# EasyEDA Pro project FOC第二版-FD6288Q-V2.0.epro, board PCB1
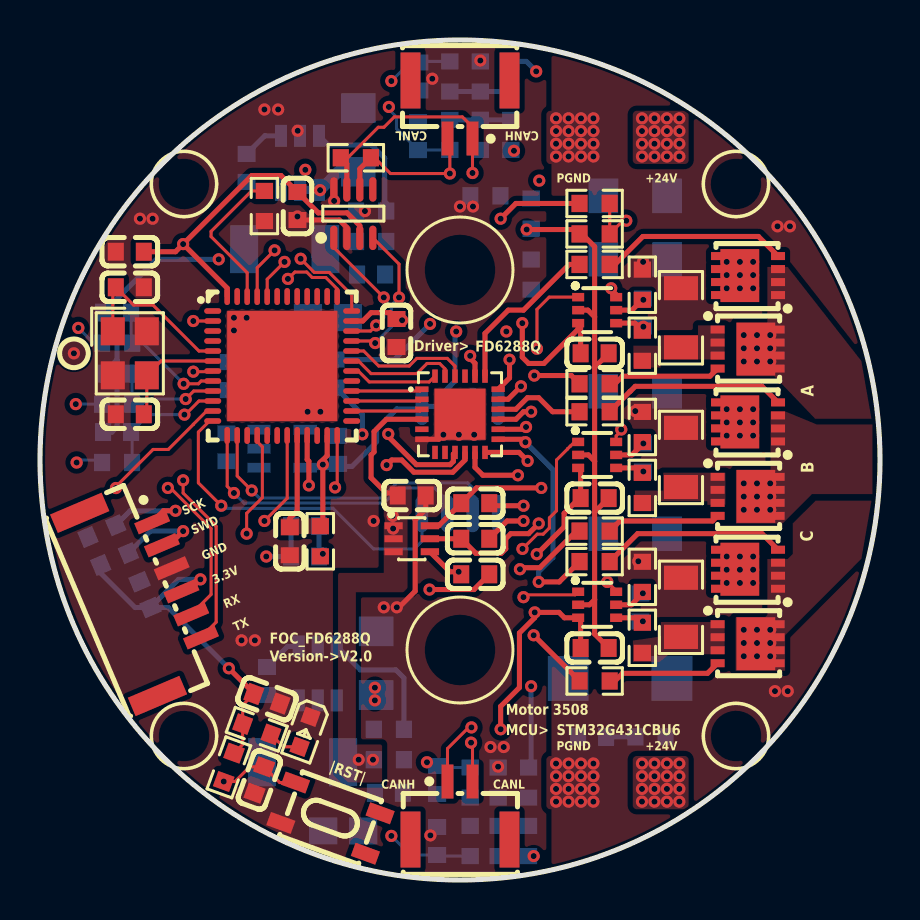
[diagram p1: board, top side]
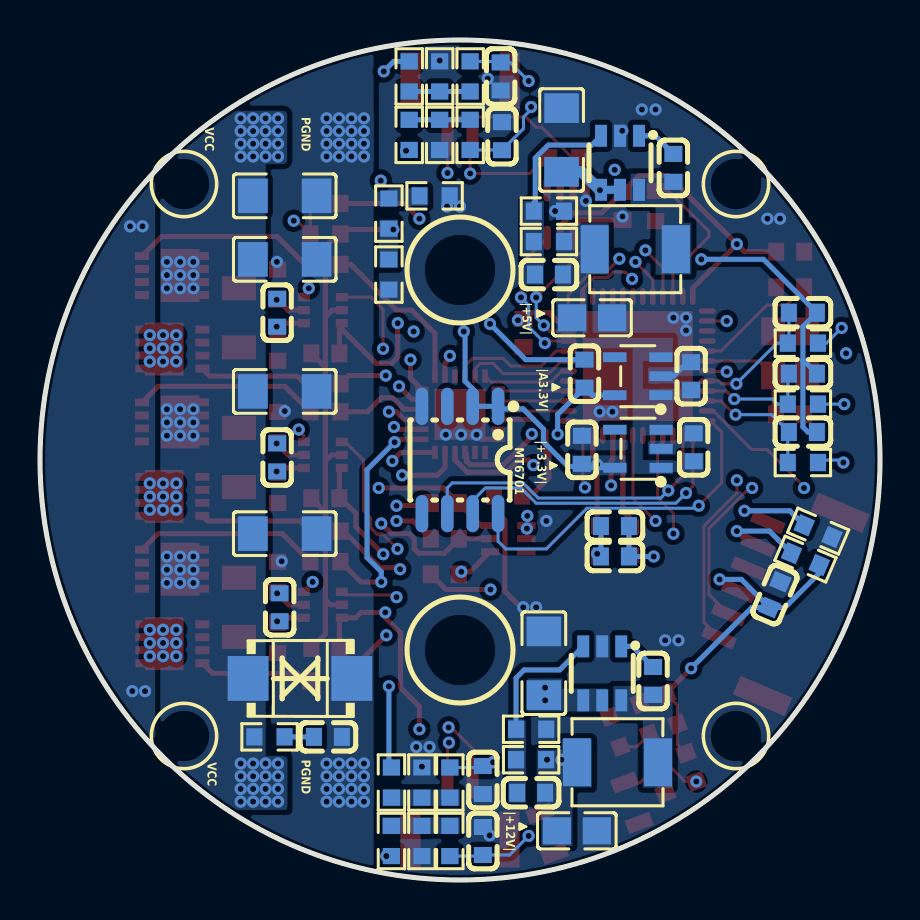
[diagram p2: board, bottom side, seen from below]

Outline 42 x 42 mm; copper layers: Top Layer, Inner1, Inner2, Bottom Layer. Coordinates in mm from the lower left corner of the outline.
Outline path: circle c21,21 r21
Stack: Top Layer 0.035mm 外层铜厚1oz / Dielectric1 0.2104mm 7628 RC49% 8.6mil / Inner1 0.0152mm 内层铜厚 / Dielectric2 1.065mm 1.1mm H/HOZ Copper / Inner2 0.0152mm 内层铜厚 / Dielectric3 0.2104mm 7628 RC49% 8.6mil / Bottom Layer 0.035mm 外层铜厚1oz

## Design rules (mm)
spacing copperThickness1oz (default): track to track 0.102, other pairs 0.152 to 0.3
spacing copperThickness2oz: track to track 0.203, other pairs 0.152 to 0.3
spacing Plane_innerPlane: track to track 0.102, other pairs 0.152 to 0.3
spacing Copper_copperRegion: track to track 0.102, other pairs 0.152 to 0.3
track width copperThickness1oz (default): min 0.127, default 0.254, max 2.54
track width copperThickness2oz: min 0.203, default 0.254, max 2.54
differential pair differentialPair (default): width min 0.127, default 0.254, max 2.54; gap min 0.152, default 0.152
pour e1140 uses Copper_copperRegion
pour e1142 uses Copper_copperRegion
pour e1144 uses Copper_copperRegion
pour e1146 uses Copper_copperRegion
pour e1148 uses Copper_copperRegion
pour e1150 uses Copper_copperRegion
pour e1152 uses Copper_copperRegion
pour e1154 uses Copper_copperRegion
pour e1156 uses Copper_copperRegion
pour e1158 uses Copper_copperRegion
pour e1160 uses Copper_copperRegion
pour e1162 uses Copper_copperRegion
pour e1164 uses Copper_copperRegion
pour e1166 uses Copper_copperRegion
pour e1168 uses Copper_copperRegion
pour e1170 uses Copper_copperRegion
pour e1182 uses Copper_copperRegion
pour e1184 uses Copper_copperRegion
pour e1187 uses Copper_copperRegion
pour e1196 uses Copper_copperRegion
pour e1201 uses Copper_copperRegion
pour e1202 uses Copper_copperRegion
pour e1206 uses Copper_copperRegion
pour e1213 uses Copper_copperRegion

## Placement (name value [footprint] x y rotation side)
C12  47uF/50V  [C1206]  15.92 37 270 bottom
C13  100pF  [C0603]  16.56 30.27 180 bottom
C14  22uF/25V  [C0805]  14.4 28.11 0 bottom
C29  10uF  [C0603]  12.87 33.7 90 top
C35  100nF  [C0603]  12.49 16.94 90 top
C36  100nF  [C0603]  4.49 31.41 0 top
C37  100nF  [C0603]  17.82 27.35 90 top
C41  1uF  [C0603]  13.25 16.17 0 bottom
C42  10nF  [C0603]  13.25 17.7 0 bottom
C45  100nF  [C0603]  10.97 5 250 top
C54  10nF/50V  [C0603]  27.6 7.16 180 bottom
C55  100uF/50V  [C1206]  29.76 24.43 0 bottom
C61  100uF/50V  [C1206]  29.76 17.32 0 bottom
C65  100nF  [C0603]  14.9 21.51 90 bottom
C68  100nF  [C0603]  11.35 9.06 340 top
C71  20pF  [C0603]  4.49 29.64 180 top
C72  20pF  [C0603]  4.49 23.29 0 top
C85  2.2nF  [C0603]  3.85 28.37 0 bottom
C88  100nF/50V  [C0603]  18.97 40.18 270 bottom
C92  1nF  [C0603]  30.02 13.63 270 bottom
C98  100nF/50V  [C0603]  19.86 1.95 90 bottom
C100  100nF  [C0603]  10.33 35.61 270 bottom
C101  100nF  [C0603]  11.35 9.95 270 bottom
C102  47uF/50V  [C1206]  16.81 10.84 270 bottom
C103  100pF  [C0603]  17.44 4.36 180 bottom
C104  22uF/25V  [C0805]  15.16 2.46 0 bottom
C105  100nF  [C0603]  9.32 21.64 90 bottom
C106  100nF  [C0603]  14.78 25.32 90 bottom
C107  100nF  [C0603]  9.44 25.19 90 bottom
C108  100uF/50V  [C1206]  29.76 31.03 0 bottom
C109  100uF/50V  [C1206]  29.76 34.21 0 bottom
C112  100nF  [C0603]  5.25 14.27 293 bottom
C113  1nF  [C0603]  30.14 21.13 270 bottom
C114  1nF  [C0603]  30.14 28.37 270 bottom
C115  2.2nF  [C0603]  3.85 25.32 0 bottom
C116  2.2nF  [C0603]  3.85 22.4 0 bottom
C117  100nF/50V  [C0603]  18.9 37.19 90 bottom
C118  100nF/50V  [C0603]  19.86 5 270 bottom
C120  100nF  [C0603]  27.73 26.33 180 top
C121  100nF  [C0603]  27.73 19.09 180 top
C122  100nF  [C0603]  27.73 11.6 180 top
C123  1uF/25V  [C0603]  21.76 15.28 180 top
C124  1uF/25V  [C0603]  21.76 17.06 180 top
C125  1uF/25V  [C0603]  21.76 18.84 180 top
C126  10uF/25V  [C0603]  18.59 19.22 180 top
CN1  WAFER-GH1.25-2PWB  [CONN-TH_2P-P1.25_XUNPU_WAFER-GH1.25-2PWB]  21 3.47 0 top
CN2  WAFER-GH1.25-2PWB  [CONN-TH_2P-P1.25_XUNPU_WAFER-GH1.25-2PWB]  21 38.53 180 top
D2  SMBJ36CA  [SMB_L4.4-W3.6-LS5.3-BI]  29 10.08 180 bottom
D3  BAS16TW  [SOT-363_L2.1-W1.3-P0.65-LS2.3-BL]  18.59 17.06 270 top
L4  3.3uH  [IND-SMD_L4.4-W4.2-A]  13.13 5.89 180 bottom
L5  3.3uH  [IND-SMD_L4.4-W4.2-A]  12.24 31.54 180 bottom
LED6  KT-0603R  [LED0603-RD]  13.25 7.41 250 top
Q7  NCEP3040Q  [POWERVDFN-8_L3.2-W3.1-P0.65-LS3.3-BL-1]  35.35 30.22 90 top
Q8  NCEP3040Q  [POWERVDFN-8_L3.2-W3.1-P0.65-LS3.3-BL-1]  35.35 22.91 90 top
Q9  NCEP3040Q  [POWERVDFN-8_L3.2-W3.1-P0.65-LS3.3-BL-1]  35.35 15.54 90 top
Q10  NCEP3040Q  [POWERVDFN-8_L3.2-W3.1-P0.65-LS3.3-BL-1]  35.43 26.55 270 top
Q11  NCEP3040Q  [POWERVDFN-8_L3.2-W3.1-P0.65-LS3.3-BL-1]  35.43 19.18 270 top
Q12  NCEP3040Q  [POWERVDFN-8_L3.2-W3.1-P0.65-LS3.3-BL-1]  35.43 11.81 270 top
R24  120  [R0603]  15.79 36.11 0 top
R28  0  [R0603]  14.01 16.94 90 top
R29  10K  [R0603]  11.22 33.7 270 top
R30  1K  [R0603]  9.44 5.63 250 top
R33  3.3  [R0603]  30.53 7.16 0 bottom
R40  56  [R0603]  3.85 26.84 0 bottom
R42  10  [R0603]  27.73 30.78 0 top
R43  34.8K  [R0603]  23.54 40.18 90 bottom
R44  56  [R0603]  20.49 40.18 90 bottom
R45  4.99K  [R0603]  22.02 40.18 270 bottom
R52  10  [R0603]  27.73 23.41 0 top
R53  10  [R0603]  27.73 15.92 0 top
R54  10  [R0603]  27.73 24.81 0 top
R56  10  [R0603]  27.73 9.95 0 top
R60  10  [R0603]  27.73 17.44 0 top
R65  34.8K  [R0603]  24.43 1.95 270 bottom
R66  56  [R0603]  21.51 1.95 270 bottom
R67  4.99K  [R0603]  22.91 1.95 90 bottom
R68  2mΩ  [R1206]  32.05 28.11 270 top
R69  2mΩ  [R1206]  32.05 21.13 270 top
R70  3mΩ  [R1206]  32.05 13.63 270 top
R72  110K  [R0603]  16.56 31.92 0 bottom
R73  15K  [R0603]  16.56 33.45 0 bottom
R74  390K  [R0603]  17.44 6.01 0 bottom
R75  20K  [R0603]  17.44 7.54 0 bottom
R79  1K  [R0603]  10.84 7.54 340 top
R80  0  [R0603]  24.56 30.27 90 bottom
R81  0  [R0603]  22.27 34.21 0 bottom
R82  0  [R0603]  24.56 33.32 90 bottom
R85  10K  [R0603]  3.73 16.05 203 bottom
R86  10K  [R0603]  3.09 17.44 23 bottom
R87  0  [R0603]  30.12 19.6 270 top
R88  0  [R0603]  30.12 22.65 90 top
R89  0  [R0603]  30.12 26.72 270 top
R90  0  [R0603]  30.12 29.76 90 top
R91  0  [R0603]  30.12 12.11 270 top
R92  0  [R0603]  30.12 15.16 90 top
R93  56  [R0603]  3.85 23.79 0 bottom
R94  56  [R0603]  3.85 20.87 0 bottom
R95  34.8K  [R0603]  23.54 37.26 270 bottom
R96  56  [R0603]  20.49 37.26 270 bottom
R97  4.99K  [R0603]  22.02 37.26 90 bottom
R98  34.8K  [R0603]  24.43 4.87 90 bottom
R99  56  [R0603]  21.51 4.87 90 bottom
R100  4.99K  [R0603]  22.91 4.87 270 bottom
R101  10K  [R0603]  27.73 33.83 0 top
R102  10K  [R0603]  27.73 32.3 180 top
SW1  K2-1808SN-A3SW-01  [SW-SMD_4P-L4.2-W3.3-P2.15-LS5.1]  14.52 3.09 340 top
U1  STM32G431CBU6  [VQFN-48_L7.0-W7.0-P0.50-BL-EP5.5]  12.11 25.7 270 top
U2  INA199A1DCKR  [SC-70-6_L2.2-W1.3-P0.65-LS2.1-BR]  27.86 28.49 180 top
U4  INA199A1DCKR  [SC-70-6_L2.2-W1.3-P0.65-LS2.1-BR]  27.86 13.76 180 top
U5  MAX3051EKA+T  [SOT-23-8_L3.0-W1.7-P0.65-LS2.8-TL]  15.67 33.32 90 top
U10  FD6288Q  [QFN-24_L4.0-W4.0-P0.50-BL-EP2.6]  21 23.29 270 top
U11  MT6701CT-STD  [SOP-8_L4.9-W3.9-P1.27-LS6.0-BL]  21 21 0 bottom
U13  SPX3819M5-L-3-3/TR  [SOT-23-5_L3.0-W1.7-P0.95-LS2.8-BL]  12.1 21.56 90 bottom
U20  INA199A1DCKR  [SC-70-6_L2.2-W1.3-P0.65-LS2.1-BR]  27.86 21.25 180 top
U23  ME3121AM6G  [SOT-23-6_L2.9-W1.6-P0.95-LS2.8-BR]  13 35.86 90 bottom
U24  ME3121AM6G  [SOT-23-6_L2.9-W1.6-P0.95-LS2.8-BR]  13.89 10.33 90 bottom
U25  SPX3819M5-L-3-3/TR  [SOT-23-5_L3.0-W1.7-P0.95-LS2.8-BL]  12.11 25.19 90 bottom
U26  WAFER-GH1.25-6PWB  [CONN-SMD_6P-P1.25_XUNPU_WAFER-GH1.25-6PWB]  5.38 14.4 293 top
X3  8MHz  [CRYSTAL-SMD_4P-L3.2-W2.5-BL]  4.49 26.33 270 top

## Footprints (pads in the part's own frame, mm; a bottom-side part is the same pattern mirrored in y, then rotated)
C0603
  rect 0.8x0.9 smd: 1(-0.7,0) 2(0.7,0)
C0805
  rect 1.41x1.35 smd: 1(-1,0) 2(1,0)
C1206
  rect 1.485x1.728 smd: 1(-1.593,0) 2(1.593,0)
CONN-SMD_6P-P1.25_XUNPU_WAFER-GH1.25-6PWB
  rect 0.6x1.7 smd: 1(-3.125,1.575) 2(-1.875,1.575) 3(-0.625,1.575) 4(0.625,1.575) 5(1.875,1.575) 6(3.125,1.575)
  rect 1x2.8 smd: 7(4.975,-1.575) 8(-4.975,-1.575)
CONN-TH_2P-P1.25_XUNPU_WAFER-GH1.25-2PWB
  rect 0.6x1.7 smd: 1(-0.625,1.45) 2(0.625,1.45)
  rect 1x2.8 smd: 3(-2.475,-1.45) 4(2.475,-1.45)
CRYSTAL-SMD_4P-L3.2-W2.5-BL
  rect 1.4x1.2 smd: 1(-1.1,-0.85) 2(1.1,-0.85) 3(1.1,0.85) 4(-1.1,0.85)
IND-SMD_L4.4-W4.2-A
  rect 1.4x2.4 smd: 1(2.028,0) 2(-2.028,0)
LED0603-RD
  rect 0.8x0.8 smd: 1(-0.799,0) 2(0.799,0)
POWERVDFN-8_L3.2-W3.1-P0.65-LS3.3-BL-1
  rect 0.4x0.7 smd: 1(-0.975,-1.55) 2(-0.325,-1.55) 3(0.325,-1.55) 4(0.975,-1.55)
  rect 0.4x0.5 smd: 5(0.975,1.55) 6(0.325,1.55) 7(-0.325,1.55) 8(-0.975,1.55)
  rect 2.65x1.94 smd: 8(0,0.36)
QFN-24_L4.0-W4.0-P0.50-BL-EP2.6
  rect 0.28x0.665 smd: 1(-1.25,-1.907) 2(-0.75,-1.907) 3(-0.25,-1.907) 4(0.25,-1.907) 5(0.75,-1.907) 6(1.25,-1.907) 13(1.25,1.907) 14(0.75,1.907) 15(0.25,1.907) 16(-0.25,1.907) 17(-0.75,1.907) 18(-1.25,1.907)
  rect 0.665x0.28 smd: 7(1.907,-1.25) 8(1.907,-0.75) 9(1.907,-0.25) 10(1.907,0.25) 11(1.907,0.75) 12(1.907,1.25) 19(-1.907,1.25) 20(-1.907,0.75) 21(-1.907,0.25) 22(-1.907,-0.25) 23(-1.907,-0.75) 24(-1.907,-1.25)
  rect 2.55x2.55 smd: 25(0,0)
R0603
  rect 0.806x0.864 smd: 1(-0.753,0) 2(0.753,0)
R1206
  rect 1.208x1.701 smd: 1(-1.479,0) 2(1.479,0)
SC-70-6_L2.2-W1.3-P0.65-LS2.1-BR
  rect 0.6x0.42 smd: 1(0.95,-0.65) 2(0.95,0) 3(0.95,0.65) 4(-0.95,0.65) 5(-0.95,0) 6(-0.95,-0.65)
SMB_L4.4-W3.6-LS5.3-BI
  rect 2.047x2.241 smd: 1(-2.591,0) 2(2.591,0)
SOP-8_L4.9-W3.9-P1.27-LS6.0-BL
  oval 0.63x1.865 smd: 1(-1.905,-2.683) 2(-0.635,-2.683) 3(0.635,-2.683) 4(1.905,-2.683) 5(1.905,2.683) 6(0.635,2.683) 7(-0.635,2.683) 8(-1.905,2.683)
SOT-23-5_L3.0-W1.7-P0.95-LS2.8-BL
  rect 0.49x1.157 smd: 1(-0.95,-1.153) 2(0,-1.153) 3(0.95,-1.153)
  rect 0.49x1.175 smd: 4(0.95,1.153) 5(-0.95,1.153)
SOT-23-6_L2.9-W1.6-P0.95-LS2.8-BR
  rect 1.1x0.6 smd: 1(1.35,-0.95) 2(1.35,0) 3(1.35,0.95) 4(-1.35,0.95) 5(-1.35,0) 6(-1.35,-0.95)
SOT-23-8_L3.0-W1.7-P0.65-LS2.8-TL
  oval 1.222x0.364 smd: 1(-1.211,0.975) 2(-1.211,0.325) 3(-1.211,-0.325) 4(-1.211,-0.975) 5(1.211,-0.975) 6(1.211,-0.325) 7(1.211,0.325) 8(1.211,0.975)
SOT-363_L2.1-W1.3-P0.65-LS2.3-BL
  rect 0.35x0.916 smd: 1(-0.65,-0.908) 2(0,-0.908) 3(0.65,-0.908) 4(0.65,0.908) 5(0,0.908) 6(-0.65,0.908)
SW-SMD_4P-L4.2-W3.3-P2.15-LS5.1
  rect 1.3x0.7 smd: 1(-2.25,1.075) 2(2.25,1.075) 3(-2.25,-1.075) 4(2.25,-1.075)
VQFN-48_L7.0-W7.0-P0.50-BL-EP5.5
  oval 0.28x0.85 smd: 1(-2.75,-3.474) 2(-2.25,-3.474) 3(-1.75,-3.474) 4(-1.25,-3.474) 5(-0.75,-3.474) 6(-0.25,-3.474) 7(0.25,-3.474) 8(0.75,-3.474) 9(1.25,-3.474) 10(1.75,-3.474) 11(2.25,-3.474) 12(2.75,-3.474) 25(2.75,3.474) 26(2.25,3.474) 27(1.75,3.474) 28(1.25,3.474) 29(0.75,3.474) 30(0.25,3.474) 31(-0.25,3.474) 32(-0.75,3.474) 33(-1.25,3.474) 34(-1.75,3.474) 35(-2.25,3.474) 36(-2.75,3.474)
  oval 0.85x0.28 smd: 13(3.474,-2.75) 14(3.474,-2.25) 15(3.474,-1.75) 16(3.474,-1.25) 17(3.474,-0.75) 18(3.474,-0.25) 19(3.474,0.25) 20(3.474,0.75) 21(3.474,1.25) 22(3.474,1.75) 23(3.474,2.25) 24(3.474,2.75) 37(-3.474,2.75) 38(-3.474,2.25) 39(-3.474,1.75) 40(-3.474,1.25) 41(-3.474,0.75) 42(-3.474,0.25) 43(-3.474,-0.25) 44(-3.474,-0.75) 45(-3.474,-1.25) 46(-3.474,-1.75) 47(-3.474,-2.25) 48(-3.474,-2.75)
  rect 5.5x5.5 smd: 49(0,0)

## Nets
As in the schematic.

Pads without a net: CN1 3 4; CN2 3 4; SW1 2 4; U1 1 3 4 15 17 18 22 25 29 38 39 40 41 42 43 47; U5 5; U10 5 7 8 21; U11 3 5; U13 4; U25 4; U26 7 8

## Via types
v1: diameter 0.61, hole 0.305, Top Layer to Bottom Layer, 256 vias

## Routing (per net, layer and track width the routed paths; a pad name or vN(x,y) marks a point on that pad's centre or on a via; arc(x,y) is an arc through that point)
+3.3V: length 136.5
  Top Layer w0.152: C68.1 10.13,8.74 R79.1 10.13,6.77 9.7,6.34
  Top Layer w0.254: U1.35 16.14,27.95 16.56,28.37 17.51,28.37 C37.2 ; U20.3 27.03,20.48 C121.2 26.97,19.09 26.21,18.33 26.21,17.66 v1(24.84,16.29) ; U1.48 9.36,29.59 v1(7.16,31.8) ; U1.20 12.86,18.45 12.49,18.08 C35.2 ; 24.94,13.38 25.95,13.38 26.22,13.11 26.91,13.11 27.03,12.99 C122.2 ; v1(7.16,31.8) 10.59,35.22 12.05,35.22 C29.2 13.92,33.36 15.35,33.36 15.99,32.72 U5.3 ; v1(7.16,31.8) 6.78,31.41 C36.2 ; v1(9.44,10.59) 10.69,9.34 C68.1 ; 7.07,14.44 7.43,14.44 v1(8.02,15.03) ; C120.2 27.03,27.72 26.91,27.84 26.91,27.54 25.19,25.83 24.43,25.83 24.11,26.14 v1(24.11,27.84) ; R28.2 14.14,17.82 14.14,21 14.36,21.22 U1.23 ; v1(24.74,13.38) 24.74,13.12 23.97,12.35 23.97,9.62 23.03,8.68 v1(23.03,7.54)
  Inner1 w0.254: v1(18.1,27.99) 19.38,26.72 20.1,26.72 v1(20.81,27.43) 20.81,28.18 16.43,32.56 7.92,32.56 v1(7.16,31.8) ; v1(9.44,10.59) 9.79,10.24 17.86,10.24 19.6,8.5 21.89,8.5 22.85,7.54 v1(23.03,7.54)
  Inner2 w0.254: v1(24.84,16.29) 24.9,16.23 25.39,16.23 25.57,16.05 25.57,14.22 v1(24.74,13.38) ; v1(8.02,15.03) 12.36,15.03 13.38,16.05 13.38,17.06 14.14,17.83 v1(14.14,20.77) ; v1(24.11,27.84) 23.84,28.11 22.14,28.11 21.46,27.43 v1(20.81,27.43)
  Bottom Layer w0.254: U13.5 14.71,20.61 C65.1 15.03,20.68 15.6,20.68 16.83,21.91 16.83,22.54 17.84,23.56 18.97,23.56 U11.1 U11.2 20.37,24.56 20.75,24.94 20.75,27.36 v1(20.81,27.43) ; v1(9.44,10.59) 6.4,13.62 C112.2 ; C112.2 4.75,13.62 3.03,15.34 R85.2 ; C112.2 6.93,15.03 v1(8.02,15.03)
+12V: length 6.7
  Top Layer w0.254: U10.4 17.32,23.04 16.7,22.42 16.7,21.4 16.56,21.25 16.56,20.11 17.32,19.35 17.89,19.35
  vias: v1(15.93,6.01) v1(16.65,6.01) v1(17.63,18.21) v1(17.66,17.57)
+AVDD_3.3V: length 24.1
  Top Layer w0.254: R101.1 23.79,33.83 v1(23.03,33.06)
  Inner2 w0.254: v1(16.12,22.29) 16.12,23.81 19.52,27.22 19.74,27.22 20.09,27.56 20.09,27.58 20.62,28.11 21.64,28.11 22,28.47 22.63,28.47 23.67,29.51 23.67,32.43 v1(23.03,33.06)
  Bottom Layer w0.254: v1(16.12,22.29) 16.12,23.28 C106.1 14.4,24.24 U25.5
AGND: length 73.8
  Top Layer w0.254: 27.73,14.02 27.73,12.3 28.43,11.6 ; 27.73,14.02 27.48,13.76 U4.2 ; 27.73,14.02 27.73,18.39 ; 27.73,25.63 27.73,20.94 ; 27.73,25.63 27.73,28.16 ; 27.73,25.63 28.43,26.33 ; 27.73,20.94 27.42,21.25 U20.2 ; 27.73,20.94 27.73,18.39 ; v1(24.33,32.52) 26.76,32.52 R102.2 27.1,32.3 27.73,31.67 27.73,28.16 ; 27.73,28.16 27.39,28.49 U2.2 ; 28.43,19.09 27.73,18.39
  Inner1 w0.254: v1(19.5,27.8) 19.5,28.85 16.17,32.18 10.71,32.18 9.57,31.03 v1(8.94,31.03)
  Inner2 w0.254: v1(24.33,32.52) 24.33,32.65 23.29,33.7 22.65,33.7 22.4,33.45 22.4,32.68 23.29,31.8 23.29,29.76 22.35,28.82 21.85,28.82 21.49,28.47 20.47,28.47 19.81,27.8 v1(19.5,27.8)
  Bottom Layer w0.254: 3.85,25.98 3.81,25.98 C115.1 ; 3.85,25.98 3.85,27.67 C85.1 5.82,31.03 v1(8.94,31.03) ; 3.85,25.98 3.85,22.65 3.6,22.4 C116.1 ; C106.2 17.72,26.02 v1(19.5,27.8)
GND: length 12.4
  Top Layer w0.254: 19.29,19.22 19.29,18.53 18.76,18 18.76,14.44 17.95,13.63 v1(17.84,13.63) ; U5.2 15.34,32.63 14.97,33 C29.1 ; v1(20.17,22.27) 19.94,22.04 U10.6
  Bottom Layer w0.254: U25.2 10.33,25.19 9.63,25.89 C107.2
  vias: v1(5,33.06) v1(5.63,33.06) v1(9.7,28.11) v1(9.7,27.48) v1(10.08,11.98) v1(10.33,28.11) v1(10.74,11.98) v1(11.22,38.53) v1(11.91,38.53) v1(12.88,37.46) v1(12.87,33.17) v1(13.38,23.41) v1(14.02,23.41) v1(14.71,33.95) v1(16.25,33.45) v1(16.68,17.95) v1(17.19,13.63) v1(19.52,2.23) v1(19.61,40.06) v1(20.94,22.27) v1(21,33.67) v1(21.65,33.67) v1(21.71,22.27) v1(22.02,40.97) v1(22.52,6.65) v1(22.91,5.67) v1(23.19,6.65)
PGND:
  vias: v1(25.8,38.08) v1(25.8,37.45) v1(25.8,36.81) v1(25.8,36.18) v1(25.8,5.82) v1(25.8,5.19) v1(25.8,4.55) v1(25.8,3.92) v1(26.43,38.08) v1(26.43,37.45) v1(26.43,36.81) v1(26.43,36.18) v1(26.43,5.82) v1(26.43,5.19) v1(26.43,4.55) v1(26.43,3.92) v1(27.05,38.08) v1(27.05,37.45) v1(27.05,36.81) v1(27.05,36.18) v1(27.05,5.82) v1(27.05,5.19) v1(27.05,4.55) v1(27.05,3.92) v1(27.67,38.08) v1(27.67,37.45) v1(27.67,36.81) v1(27.67,36.18) v1(27.67,5.82) v1(27.67,5.19) v1(27.67,4.55) v1(27.67,3.92) v1(29.76,23.45) v1(29.91,15.94) v1(30.16,30.91) v1(36.75,9.44) v1(36.88,32.68) v1(37.39,9.44) v1(37.5,32.68)
VCC: length 3.3
  Bottom Layer w0.406: U23.5 13.99,34.51 v1(14,34.49)
  Bottom Layer w0.559: v1(14,34.49) 14.92,35.41 C12.2
  vias: v1(13.27,35.51) v1(16.74,9.62) v1(16.74,8.98) v1(24.68,1.2) v1(30.1,38.08) v1(30.1,37.45) v1(30.1,36.81) v1(30.1,36.18) v1(30.1,5.82) v1(30.1,5.19) v1(30.1,4.55) v1(30.1,3.92) v1(30.72,38.08) v1(30.72,37.45) v1(30.72,36.81) v1(30.72,36.18) v1(30.72,5.82) v1(30.72,5.19) v1(30.72,4.55) v1(30.72,3.92) v1(31.34,38.08) v1(31.35,37.45) v1(31.35,36.81) v1(31.35,36.18) v1(31.35,5.82) v1(31.35,5.19) v1(31.35,4.55) v1(31.34,3.92) v1(31.97,38.08) v1(31.97,37.45) v1(31.97,36.81) v1(31.97,36.18) v1(31.97,5.82) v1(31.97,5.19) v1(31.97,4.55) v1(31.97,3.92) v1(34.34,30.91) v1(34.34,30.25) v1(34.34,29.58) v1(34.34,23.54) v1(34.34,22.88) v1(34.34,22.22) v1(34.34,16.17) v1(34.34,15.51) v1(34.34,14.85) v1(35,30.91) v1(35,30.25) v1(35,29.58) v1(35,23.54) v1(35,22.88) v1(35,22.22) v1(35,16.17) v1(35,15.51) v1(35,14.85) v1(35.66,30.91) v1(35.66,30.25) v1(35.66,29.58) v1(35.66,23.54) v1(35.66,22.88) v1(35.66,22.22) v1(35.66,16.17) v1(35.66,15.51) v1(35.66,14.85)
VDDA: length 9.7
  Top Layer w0.254: U1.21 13.36,21.02 13.44,20.94 v1(13.44,19.73)
  Inner2 w0.254: v1(11.31,16.17) 13.44,18.3 v1(13.44,19.73)
  Bottom Layer w0.254: C42.1 C41.1 v1(11.31,16.17)
ADC_IN1: length 6.5
  Top Layer w0.152: v1(7.18,24.81) 7.92,24.81 8.06,24.95 U1.8
  Bottom Layer w0.152: 4.56,28.37 4.56,26.9 R40.2 5.15,26.84 v1(7.18,24.81)
ADC_IN2: length 5.8
  Top Layer w0.152: U1.9 7.69,24.45 v1(7.28,24.05)
  Bottom Layer w0.152: 4.56,25.32 4.61,25.26 R93.2 5.12,23.79 5.38,24.05 v1(7.28,24.05)
ADC_IN3: length 6.3
  Top Layer w0.152: v1(7.22,23.27) 7.26,23.27 7.95,23.95 U1.10
  Bottom Layer w0.152: v1(7.22,23.27) 5.43,23.27 4.56,22.4 4.61,22.34 R94.2
ADC_IN4: length 33.9
  Top Layer w0.152: v1(3.8,19.6) 3.8,19.67 5.65,21.53 6.41,21.53 7.66,22.78 7.66,22.78 8.33,23.45 U1.11
  Inner2 w0.152: v1(17.57,2.2) 17.57,3.62 3.8,17.39 v1(3.8,19.6)
  Bottom Layer w0.152: v1(17.57,2.2) 18.52,1.25 C98.1 19.91,1.2 R66.2
BOOT0: length 7.5
  Top Layer w0.152: U1.46 10.36,30.36 8.55,32.17 8.55,32.43 10.58,34.45 R29.1
CANH: length 47.6
  Top Layer w0.152: R24.1 15.39,36.11 16.91,37.64 17.2,37.64 17.72,38.15 21.12,38.15 21.62,37.65 CN2.1 v1(21.62,35.35) ; CN1.1 20.38,6.57 21.43,7.63 v1(21.57,7.63)
  Top Layer w0.254: R24.1 15.34,35.81 U5.7
  Inner2 w0.152: v1(21.62,35.35) 18.97,32.69 18.97,27.1 15.58,23.71 15.58,14.47 21.57,8.48 v1(21.57,7.63)
CANL: length 47.4
  Top Layer w0.152: CN2.2 20.49,36.96 v1(20.49,35.32) 17.52,35.32 16.73,36.11 R24.2 ; v1(21.55,6.87) 21.62,6.8 CN1.2
  Top Layer w0.254: U5.6 15.99,35.56 R24.2
  Inner2 w0.152: v1(21.55,6.87) 19.79,8.63 19.79,8.75 arc(19.67,9.04) 19.79,9.33 arc(19.91,9.62) 19.79,9.9 19.29,10.41 arc(19,10.53) 18.72,10.41 arc(18.43,10.29) 18.14,10.41 17.64,10.91 arc(17.52,11.2) 17.64,11.48 arc(17.76,11.77) 17.64,12.06 17.13,12.56 arc(16.85,12.68) 16.56,12.56 arc(16.27,12.44) 15.99,12.56 15.28,13.26 15.28,21.21 arc(15.25,21.3) 15.16,21.33 arc(15.07,21.37) 15.03,21.46 15.03,22.73 arc(15.07,22.82) 15.16,22.86 arc(15.25,22.89) 15.28,22.98 15.28,23.92 15.63,24.26 arc(15.79,24.66) 15.63,25.06 arc(15.46,25.46) 15.63,25.85 15.91,26.14 arc(16.31,26.3) 16.71,26.14 arc(17.1,25.97) 17.5,26.14 18.71,27.35 18.71,29.39 arc(18.6,29.67) 18.33,29.78 arc(18.05,29.89) 17.94,30.17 17.94,30.92 arc(18.05,31.19) 18.33,31.31 arc(18.6,31.42) 18.71,31.69 18.71,33.06 20.49,34.84 v1(20.49,35.32)
FDCAN1_RX: length 7.5
  Top Layer w0.152: U5.4 17.95,30.8 v1(17.95,29.13) ; v1(16.76,26.85) 16.66,26.95 U1.33
  Bottom Layer w0.152: v1(16.76,26.85) 17.57,27.66 17.57,28.75 v1(17.95,29.13)
FDCAN1_TX: length 6.9
  Top Layer w0.152: U5.1 14.69,31.63 v1(17.19,29.13) ; U1.34 16.53,27.45 v1(16.81,27.73)
  Bottom Layer w0.152: v1(17.19,29.13) 17.19,28.11 v1(16.81,27.73)
GH_A: length 8.3
  Top Layer w0.254: U10.19 22.25,27.33 23.41,28.49 24.18,28.49 26.46,30.78 R42.1
GH_B: length 4.6
  Top Layer w0.254: R52.1 25.63,23.41 24.93,24.11 24.37,24.11 23.79,23.54 U10.16
GH_C: length 11.8
  Top Layer w0.254: U10.13 24.16,22.04 24.27,21.92 v1(24.27,21.89) ; v1(24.94,14.9) 25.96,14.9 R53.1
  Bottom Layer w0.254: v1(24.94,14.9) 24.94,15.41 25.65,16.12 25.65,20.51 v1(24.27,21.89)
GL_A: length 12.2
  Top Layer w0.254: U10.11 21.75,20.63 22.14,20.24 v1(23.9,20.24) ; R54.1 26.57,25.22 v1(24.71,25.22)
  Inner1 w0.254: v1(23.9,20.24) 24.56,20.24 25.7,21.38 25.7,24.56 25.03,25.22 v1(24.71,25.22)
GL_B: length 17.5
  Top Layer w0.254: v1(24,15.54) 24.07,15.61 24.99,15.61 26.82,17.44 R60.1 ; U10.10 21.25,21 20.64,20.39 18.69,20.39 18.08,21 17.59,21 v1(17.33,20.75)
  Inner2 w0.254: v1(24,15.54) 23.54,15.54 22.65,16.43 21.76,16.43 17.44,20.75 v1(17.33,20.75)
GL_C: length 24.7
  Top Layer w0.254: v1(17.41,22.3) 17.41,22.17 18.82,20.77 20.51,20.77 20.67,20.93 20.67,21.3 U10.9 ; R56.1 24.69,12.24 v1(24.68,12.24)
  Inner2 w0.254: v1(17.41,22.3) 16.97,22.3 16.04,21.37 16.04,20.21 16.05,20.2 16.05,16.81 18.92,13.94 23.11,13.94 24.68,12.36 v1(24.68,12.24)
NRST: length 35.1
  Top Layer w0.152: SW1.1 11.99,4.87 C45.1 10.48,5.66 9.75,4.92 v1(9.19,4.92) ; U1.7 8.6,25.42 v1(7.66,25.42)
  Inner1 w0.152: v1(7.66,25.42) 2.66,25.42 0.55,23.31 0.55,19.86 4.36,16.05 4.36,14.65 9.19,9.83 v1(9.19,4.92)
OSC_IN: length 8.4
  Top Layer w0.152: X3.1 3.64,29.49 C71.2 4.68,28.75 5.65,28.75 7.95,26.45 U1.5
OSC_OUT: length 5.6
  Top Layer w0.152: C72.2 5.34,23.44 X3.3 6.06,25.95 U1.6
PWMAH: length 6.3
  Top Layer w0.152: U1.32 16.19,26.45 16.94,25.7 18.46,25.7 18.84,26.08 20.37,26.08 20.75,25.69 U10.22
PWMAL: length 3.5
  Top Layer w0.152: U1.28 19.01,24.45 U10.1
PWMBH: length 5.6
  Top Layer w0.152: U10.23 20.25,25.56 19.98,25.83 19.35,25.83 18.84,25.32 16.56,25.32 15.92,25.95 U1.31
PWMBL: length 3.5
  Top Layer w0.152: U10.2 19.01,23.95 U1.27
PWMCH: length 4.5
  Top Layer w0.152: U1.30 15.92,25.45 16.46,24.9 19.46,24.9 U10.24
PWMCL: length 3.5
  Top Layer w0.152: U10.3 19.01,23.45 U1.26
REF: length 39
  Top Layer w0.152: v1(29.31,32.96) 29.15,32.96 R102.1 R101.2 ; v1(24.18,14.14) 24.29,14.26 26.76,14.26 U4.1 ; v1(24.12,16.56) 24.86,17.29 25.16,17.29 25.47,17.6 25.47,18.11 25.83,18.46 25.83,21 26.38,21.55 26.38,21.56 26.51,21.69 26.52,21.69 26.73,21.9 U20.1 ; U2.1 25.46,29.14 24.85,28.53 v1(24.85,26.56)
  Inner1 w0.152: v1(24.12,16.56) 24.86,17.29 25.16,17.29 25.47,17.6 25.47,18.11 26.08,18.72 26.08,25.33 v1(24.85,26.56)
  Inner2 w0.152: v1(29.31,32.96) 29.28,32.96 27.73,31.41 27.73,29.44 v1(24.85,26.56) ; v1(24.18,14.14) 24.18,14.96 24.53,15.32 24.53,15.76 24.18,16.11 24.18,16.5 v1(24.12,16.56)
SH_A: length 52.8
  Top Layer w0.254: v1(23.48,26.02) 23.48,25.11 U10.18 ; C123.1 21.7,14.52 v1(19.48,14.52)
  Inner1 w0.254: v1(24.96,34.97) 24.96,40.28 v1(24.81,40.43)
  Inner2 w0.254: 23.64,25.92 23.64,26.18 24.92,27.46 24.92,34.92 v1(24.96,34.97) ; 23.64,25.92 23.71,25.85 35.12,25.85 v1(35.19,25.92) ; 23.64,25.92 23.57,25.92 v1(23.48,26.02) 22.65,26.84 19.86,26.84 18.71,25.7 18.71,25.57 18.08,24.93 18.08,21.94 17.82,21.69 16.86,21.69 16.39,21.22 16.39,20.36 18.71,18.03 18.71,15.28 v1(19.48,14.52)
  Bottom Layer w0.254: 24.68,40.56 24.31,40.93 R43.2
  vias: v1(35.19,27.25) v1(35.19,26.58) v1(35.85,27.25) v1(35.85,26.58) v1(35.85,25.92) v1(36.51,27.25) v1(36.51,26.58) v1(36.51,25.92)
SH_B: length 37.7
  Top Layer w0.254: U10.15 23.8,23.04 24.18,23.41 v1(24.56,23.41) ; v1(24.18,17.95) 23.35,17.95 C124.1
  Inner1 w0.254: v1(24.56,23.41) 24.49,23.48 23.86,23.48 23.22,24.11 23.22,24.81 24.06,25.65 24.06,26.83 23.46,27.43 v1(23.32,27.43) 23.32,28.65 23.7,29.03 v1(23.7,36.46)
  Inner2 w0.254: v1(24.56,23.41) 25.83,22.14 25.83,19.54 24.24,17.95 23.98,17.95 24.7,17.24 25.24,17.24 26.14,18.14 34.82,18.14 v1(35.19,18.51)
  vias: v1(35.19,19.83) v1(35.19,19.17) v1(35.85,19.83) v1(35.85,19.17) v1(35.85,18.51) v1(36.51,19.83) v1(36.51,19.17) v1(36.51,18.51)
SH_C: length 31.9
  Top Layer w0.254: v1(24.18,18.71) 22.59,18.71 C125.1 ; U10.12 23.96,21.38 v1(24.38,20.95)
  Inner1 w0.254: v1(24.56,9.69) 23.41,10.83 23.41,18.33 23.79,18.71 v1(24.18,18.71)
  Inner2 w0.254: v1(24.38,20.95) 24.48,20.85 24.48,19.02 v1(24.18,18.71) ; v1(24.56,9.69) 33.68,9.69 v1(35.19,11.19)
  Bottom Layer w0.254: v1(24.56,9.69) 24.56,5.75 R98.2
  vias: v1(35.19,12.51) v1(35.19,11.85) v1(35.85,12.51) v1(35.85,11.85) v1(35.85,11.19) v1(36.51,12.51) v1(36.51,11.85) v1(36.51,11.19)
SN1: length 1.5
  Top Layer w0.254: R90.1 29.6,28.49 U2.5
  vias: v1(30.17,29.01)
SN2: length 1.6
  Top Layer w0.254: v1(30.17,21.83) 29.59,21.25 U20.5
SN3: length 1.6
  Top Layer w0.254: v1(30.14,14.33) 29.57,13.76 U4.5
SP1: length 1.5
  Top Layer w0.254: 28.81,27.84 29.74,27.84 R89.1
  vias: v1(30.17,27.67)
SP2: length 1.4
  Top Layer w0.254: R87.1 29.87,20.6 U20.4
  vias: v1(30.17,20.43)
SP3: length 1.4
  Top Layer w0.254: v1(30.14,12.93) 29.97,13.11 28.81,13.11
SPI1_CS: length 17.6
  Top Layer w0.152: U1.12 8.47,22.95 7.92,22.4 7.92,19.86 v1(9.06,18.71)
  Bottom Layer w0.152: U11.8 19.09,16.94 18.71,16.56 16.68,16.56 14.65,18.59 9.19,18.59 v1(9.06,18.71)
SPI1_MISO: length 16
  Top Layer w0.152: U1.14 9.86,20.2 v1(10.59,19.48)
  Bottom Layer w0.152: v1(10.59,19.48) 10.97,19.09 17.08,19.09 17.85,19.86 21.38,19.86 21.63,19.6 U11.6
SPI1_SCK: length 15.1
  Top Layer w0.152: v1(9.7,19.35) 9.36,19.69 U1.13
  Bottom Layer w0.152: U11.7 20.37,18.97 19.73,19.6 17.95,19.6 17.19,18.84 10.21,18.84 v1(9.7,19.35)
SWCLK: length 22
  Top Layer w0.152: U1.37 14.86,29.55 14.29,30.12 13.61,30.12 13.34,30.4 12.75,30.4 12.4,30.06 v1(12.4,30.06)
  Top Layer w0.254: v1(6.78,18.46) 6.18,18.46 U26.1
  Inner2 w0.152: v1(12.4,30.06) 12.4,27.36 10.08,25.04 10.08,21.76 9.96,21.65 9.96,21.52 6.9,18.46 v1(6.78,18.46)
  Bottom Layer w0.254: R86.2 4.51,18.46 v1(6.78,18.46)
SWDIO: length 24.7
  Top Layer w0.152: U1.36 15.58,29.25 14.46,30.38 13.71,30.38 v1(13.03,31.06)
  Top Layer w0.254: v1(7.16,17.44) 6.45,16.74 U26.2
  Inner2 w0.152: v1(7.16,17.44) 7.31,17.6 7.31,18.51 10.46,21.66 10.46,25.06 13.03,27.64 v1(13.03,31.06)
  Bottom Layer w0.254: R85.1 5.52,17.44 v1(7.16,17.44)
TEST: length 7.6
  Top Layer w0.152: U1.2 v1(7.66,27.95)
  Inner1 w0.152: v1(1.7,26.33) 6.05,26.33 v1(7.66,27.95)
U1_RX: length 24.8
  Top Layer w0.152: v1(11.73,31.48) 10.86,30.61 U1.45 ; 6.52,19.6 8.55,17.57 8.55,14.28 U26.5
  Inner2 w0.152: v1(11.73,31.48) 10.97,30.72 10.97,26.72 9.45,25.2 9.45,22.4 7.8,20.75 7.03,20.75 6.4,20.11 v1(6.4,19.6)
U1_TX: length 24.5
  Top Layer w0.152: 8.05,12.14 8.81,12.89 8.81,17.68 8.68,17.8 8.68,17.83 7.16,19.35 v1(7.16,19.98) ; v1(12.23,30.91) 11.36,30.04 U1.44
  Inner2 w0.152: v1(7.16,19.98) 8.07,19.98 9.71,21.62 9.71,25.03 11.31,26.63 11.31,29.71 11.86,30.27 11.86,30.28 12.18,30.59 12.19,30.59 12.23,30.63 v1(12.23,30.91)
VA_AD: length 44
  Top Layer w0.152: U1.16 10.85,22.21 10.85,21.93 11.12,21.66 11.12,19.12 10.33,18.33 v1(10.33,17.32)
  Inner2 w0.152: v1(17.57,39.95) 16.2,39.95 6.14,29.89 6.14,21.03 4.62,19.51 4.62,17.7 6.27,16.05 9.06,16.05 v1(10.33,17.32)
  Bottom Layer w0.152: v1(17.57,39.95) 18.5,40.88 18.97,40.88 19.02,40.93 R44.2
VB_A: length 19.3
  Top Layer w0.254: v1(20.94,15.41) 20.5,15.41 19.5,16.41 ; U10.20 21.75,25.84 21.51,26.08 v1(21.51,26.21)
  Inner2 w0.254: v1(20.94,15.41) 21.25,15.73 21.25,16 16.75,20.5 16.75,20.99 17.09,21.33 18.16,21.33 18.46,21.64 18.46,24.81 19.86,26.21 v1(21.51,26.21)
VB_AD: length 43.1
  Top Layer w0.152: v1(11.22,17.95) 12.36,19.09 U1.19
  Inner2 w0.152: v1(11.22,17.95) 10.03,17.95 8.64,16.56 6.4,16.56 5.12,17.83 5.12,19.35 6.65,20.87 6.65,29.65 15.66,38.65 v1(17.44,38.65)
  Bottom Layer w0.152: 17.51,38.46 17.82,38.14 17.82,37.57 C117.1 18.91,36.5 R96.2
VB_B: length 16.4
  Top Layer w0.254: U10.17 23.4,24.04 v1(24.05,24.68) ; v1(24.94,17.82) 24.43,17.32 23.54,17.32 23.29,17.06 23.29,16.56 23.06,16.33 21.79,16.33 C124.2 19.5,17.06
  Inner2 w0.254: v1(24.94,17.82) 26.21,19.09 26.21,22.59 24.49,24.3 24.43,24.3 v1(24.05,24.68)
VB_C: length 11.5
  Top Layer w0.254: 19.5,17.71 19.93,17.71 C125.2 21.82,19.6 v1(25.06,19.6) ; U10.14 24.19,22.54 v1(24.3,22.65)
  Inner2 w0.254: v1(25.06,19.6) 25.44,19.98 25.44,21.54 24.51,22.47 24.48,22.47 v1(24.3,22.65)
VC_AD: length 20.6
  Top Layer w0.152: U1.24 14.86,19.74 v1(14.75,19.63)
  Inner2 w0.152: v1(19.35,5.89) 19.35,8.43 14.75,13.02 v1(14.75,19.63)
  Bottom Layer w0.152: R99.2 19.93,5.62 C118.1 19.67,5.89 v1(19.35,5.89)
$1N8514: length 5.8
  Top Layer w0.254: Q12.4 33.37,10.33 29.13,10.33 28.75,9.95 R56.2
$1N8531: length 5.7
  Top Layer w0.254: Q11.4 33.63,17.95 28.99,17.95 R60.2
$1N8536: length 9.3
  Top Layer w0.254: Q8.4 36.1,24.68 29.76,24.68 29.51,24.43 29.5,24.43 R52.2
$1N8537: length 9.3
  Top Layer w0.254: Q9.4 36.1,17.32 29.88,17.32 R53.2
$1N8558: length 5.7
  Top Layer w0.254: Q10.4 33.5,25.19 29.13,25.19 28.75,24.81 R54.2
$1N8570: length 39.4
  Top Layer w0.152: v1(28.37,14.9) 28.81,14.46 U4.6
  Inner1 w0.152: v1(1.83,20.87) 1.83,20.23 5.38,16.68 5.38,14.78 6.01,14.14 11.98,14.14 15.09,11.03 18.46,11.03 20.14,9.35 22.37,9.35 23.16,8.55 24.68,8.55 28.11,11.98 28.11,14.65 v1(28.37,14.9)
  Bottom Layer w0.152: R94.1 2.98,20.99 1.95,20.99 v1(1.83,20.87)
$1N8589: length 1.5
  Bottom Layer w0.254: C42.2 C41.2
  vias: v1(14.14,16.31)
$1N8638: length 40.2
  Top Layer w0.152: v1(28.56,29.59) 28.81,29.34 U2.6
  Inner1 w0.152: v1(1.92,27.6) 13.73,39.42 23.16,39.42 24.43,38.14 24.43,33.72 v1(28.56,29.59)
  Bottom Layer w0.152: v1(1.92,27.6) 2.68,26.84 R40.1
$1N8667: length 2.1
  Bottom Layer w0.254: U23.1 11.24,37.21 C100.1
$1N8669: length 6.4
  Bottom Layer w0.254: R73.2 17.31,33.85 17.24,33.92 17.24,36.09 16.58,36.75 14.41,36.75 U23.3
$1N8681: length 6.6
  Bottom Layer w0.254: R75.2 18.2,10.1 17.79,10.5 16.01,10.5 U24.3
$1N8684: length 9.4
  Top Layer w0.254: Q7.4 35.92,32.18 30.14,32.18 28.75,30.78 R42.2
$1N8695: length 1.7
  Top Layer w0.152: LED6.2 12.17,6.66 R79.2
$1N8754: length 1.6
  Bottom Layer w0.254: R33.1 28.18,7.16
$1N8755: length 2.1
  Bottom Layer w0.254: 13.06,11.68 12.38,11.68 C101.1
$1N9165: length 52.4
  Top Layer w0.152: v1(29.06,22.52) 29.06,22.46 28.81,22.2 U20.6
  Inner1 w0.152: v1(29.06,22.52) 29.25,22.33 29.25,12.36 25.06,8.17 22.65,8.17 22.02,8.81 19.73,8.81 17.95,10.59 14.78,10.59 11.73,13.63 5.76,13.63 4.74,14.65 4.74,16.17 0.81,20.11 0.81,22.81 v1(1.79,23.79)
  Bottom Layer w0.152: v1(1.79,23.79) R93.1
$1N11836: length 3
  Bottom Layer w0.254: R43.1 R45.2 R44.1
$1N11951: length 3
  Bottom Layer w0.254: R96.1 R97.2 R95.1

## Copper pours and planes (outline as drawn; the poured copper is in the pictures)
+3.3V on Top Layer: 12.05,18.08 14.38,18.08 14.38,17.3 12.05,17.3
+3.3V on Bottom Layer: 12.7,21.3 15.41,21.3 15.41,20.24 12.7,20.24
+5V on Bottom Layer: 8.94,24.95 10.97,24.95 10.97,23.92 8.94,23.92
+5V on Bottom Layer: 8.81,21.36 10.86,21.36 10.86,20.41 8.81,20.41
+5V on Bottom Layer: 13.57,32.83 16.17,32.83 16.17,27.36 13.57,27.36
+5V on Bottom Layer: 10.33,29 16.17,29 16.17,20.3 10.33,20.3
+12V on Top Layer: 17.19,19.74 18.59,19.74 18.59,16.17 17.19,16.17
+12V on Top Layer: 15.41,4.87 17.11,4.87 17.11,6.78 15.79,6.78 15.79,14.39 18.59,14.39 18.59,16.56 17.19,16.56 17.19,15.36 14.9,15.36 14.9,5.38
+12V on Bottom Layer: 14.4,7.03 17.16,7.03 17.16,1.7 14.4,1.7
AGND on Bottom Layer: 24.09,33.02 25.06,33.02 25.06,30.61 24.09,30.61
AGND on Inner2: 23.7,33.56 24.92,33.56 24.92,29.27 23.7,29.27
GND on Top Layer: -1.61,42.34 25.32,42.34 25.32,-0.34 -1.61,-0.34
GND on Bottom Layer: 47.29,43.86 47.29,-0.84 -1.1,-0.84 -1.1,43.99 -0.97,43.86
GND on Inner1: -2.24,43.99 44.5,43.99 44.5,-4.27 -2.24,-4.27
GND on Inner2: 21,11.5 15.72,11.5 15.72,25.85 18.08,28.22 18.08,28.24 18.12,28.24 18.71,28.83 18.71,33.19 19.22,33.19 20.11,34.08 22.27,34.08 22.4,33.95 22.4,32.68 24.92,32.68 24.92,25.42 24.3,24.81 24.3,24.49 25.41,23.39 25.41,16.92 21,12.51
PGND on Top Layer: 24.81,43.35 47.92,43.35 47.92,-0.72 24.81,-0.72
PGND on Top Layer: 28.11,3.74 28.1,3.66 28.05,3.6 27.99,3.55 27.91,3.54 25.52,3.54 25.44,3.55 25.38,3.6 25.33,3.66 25.32,3.74 25.32,6 25.33,6.08 25.38,6.14 25.44,6.19 25.52,6.2 27.91,6.2 27.99,6.19 28.05,6.14 28.1,6.08 28.11,6
PGND on Top Layer: 29.55,16.33 32.9,16.33 32.9,14.48 29.55,14.48
PGND on Top Layer: 29.67,23.85 32.92,23.85 32.92,22.02 29.67,22.02
PGND on Top Layer: 25.32,38.26 25.33,38.34 25.38,38.4 25.44,38.45 25.52,38.46 27.91,38.46 27.99,38.45 28.05,38.4 28.1,38.34 28.11,38.26 28.11,36 28.1,35.92 28.05,35.86 27.99,35.81 27.91,35.8 25.52,35.8 25.44,35.81 25.38,35.86 25.33,35.92 25.32,36
PGND on Top Layer: 29.67,30.96 32.93,30.96 32.93,29.06 29.67,29.06
PGND on Bottom Layer: 25.32,38.26 25.33,38.34 25.38,38.4 25.44,38.45 25.52,38.46 27.91,38.46 27.99,38.45 28.05,38.4 28.1,38.34 28.11,38.26 28.11,36 28.1,35.92 28.05,35.86 27.99,35.81 27.91,35.8 25.52,35.8 25.44,35.81 25.38,35.86 25.33,35.92 25.32,36
PGND on Bottom Layer: 28.11,3.74 28.1,3.66 28.05,3.6 27.99,3.55 27.91,3.54 25.52,3.54 25.44,3.55 25.38,3.6 25.33,3.66 25.32,3.74 25.32,6 25.33,6.08 25.38,6.14 25.44,6.19 25.52,6.2 27.91,6.2 27.99,6.19 28.05,6.14 28.1,6.08 28.11,6
PGND on Bottom Layer: 25.32,42.72 25.32,34.59 22.59,34.59 22.59,33.7 25.32,33.7 25.32,-1.99 42.84,-1.99 42.84,40.43 45.38,42.97 25.57,42.97
PGND on Inner1: 29.46,23.85 29.46,12.54 36.11,12.54 36.11,6.73 42.21,6.73 42.21,35.48 36.37,35.48 36.37,23.88 36.33,23.85
PGND on Inner2: -3.51,46.65 47.03,46.65 47.03,-1.99 -3.51,-1.99
VCC on Top Layer: 29.64,38.26 29.65,38.34 29.7,38.4 29.76,38.45 29.84,38.46 32.23,38.46 32.3,38.45 32.37,38.4 32.41,38.34 32.43,38.26 32.43,36 32.41,35.92 32.37,35.86 32.3,35.81 32.23,35.8 29.84,35.8 29.76,35.81 29.7,35.86 29.65,35.92 29.64,36
VCC on Top Layer: 32.43,3.74 32.41,3.66 32.37,3.6 32.3,3.55 32.23,3.54 29.84,3.54 29.76,3.55 29.7,3.6 29.65,3.66 29.64,3.74 29.64,6 29.65,6.08 29.7,6.14 29.76,6.19 29.84,6.2 32.23,6.2 32.3,6.19 32.37,6.14 32.41,6.08 32.43,6
VCC on Bottom Layer: 29.64,3.51 29.64,6.14 30.71,6.14 30.71,35.86 29.76,35.86 29.76,38.4 35.99,38.4 35.99,3.51
VCC on Bottom Layer: 29.64,38.26 29.65,38.34 29.7,38.4 29.76,38.45 29.84,38.46 32.23,38.46 32.3,38.45 32.37,38.4 32.41,38.34 32.43,38.26 32.43,36 32.41,35.92 32.37,35.86 32.3,35.81 32.23,35.8 29.84,35.8 29.76,35.81 29.7,35.86 29.65,35.92 29.64,36
VCC on Bottom Layer: 32.43,3.74 32.41,3.66 32.37,3.6 32.3,3.55 32.23,3.54 29.84,3.54 29.76,3.55 29.7,3.6 29.65,3.66 29.64,3.74 29.64,6 29.65,6.08 29.7,6.14 29.76,6.19 29.84,6.2 32.23,6.2 32.3,6.19 32.37,6.14 32.41,6.08 32.43,6
VCC on Bottom Layer: 13.63,10.08 17.61,10.08 17.61,8.43 13.63,8.43
VCC on Inner1: 29.64,3.51 29.64,6.14 30.71,6.14 30.71,35.86 29.76,35.86 29.76,38.4 35.99,38.4 35.99,3.51
VCC on Inner1: 15.79,10.08 15.79,8.3 17.19,6.9 17.19,5.32 20.11,2.4 22.81,2.4 23.77,1.44 23.77,0.56 25.08,0.56 25.95,0.81 28.16,1.47 29.45,1.95 31.03,3.54 32.43,3.54 32.43,6.27 29.64,6.27 29.64,3.59 29.03,2.84 27.99,2.84 26.5,1.82 24.8,1.82 23.29,3.33 20.35,3.33 17.92,5.77 17.92,10.08
VCC on Inner2: 12.87,33.95 14.14,33.95 14.9,34.72 14.9,36.24 16.3,37.64 23.63,37.64 24.64,38.64 29.27,38.64 29.64,38.27 29.64,35.73 32.56,35.73 32.56,39.16 31.54,40.18 30.63,39.27 24.39,39.27 23.54,38.42 15.62,38.42 13.26,36.06 13.06,36.06 12.87,35.87
SH_A on Top Layer: 34.84,30.65 41.57,30.65 41.57,23.06 34.84,23.06
SH_B on Top Layer: 34.8,23.43 41.62,23.43 41.62,17.83 34.8,17.83
SH_C on Top Layer: 34.78,18.97 41.57,18.97 41.57,10.46 34.78,10.46
SL_A on Top Layer: 29.67,27.73 34.23,27.73 34.23,25.62 29.67,25.62
SL_B on Top Layer: 29.74,20.36 34.27,20.36 34.27,18.46 29.74,18.46
SL_C on Top Layer: 29.64,12.9 34.23,12.9 34.23,10.89 29.64,10.89
TEST on Top Layer: 2.38,26.4 2.35,26.53 2.3,26.66 2.22,26.77 2.13,26.86 2.02,26.94 1.89,26.99 1.76,27.01 1.63,27.01 1.5,26.99 1.37,26.94 1.26,26.86 1.17,26.77 1.09,26.66 1.04,26.53 1.02,26.4 1.02,26.27 1.04,26.14 1.09,26.01 1.17,25.9 1.26,25.81 1.37,25.73 1.5,25.68 1.63,25.65 1.76,25.65 1.89,25.68 2.02,25.73 2.13,25.81 2.22,25.9 2.3,26.01 2.35,26.14 2.38,26.27
$1N8545 on Bottom Layer: 21,3.14 24.9,3.14 24.9,2.32 21,2.32
$1N8669 on Bottom Layer: 16.8,33.95 17.83,33.95 17.83,29.76 16.8,29.76
$1N8679 on Bottom Layer: 10.37,9.7 13.33,9.7 13.33,4.62 10.37,4.62
$1N8681 on Bottom Layer: 17.7,8.05 18.59,8.05 18.59,3.86 17.7,3.86
$1N8699 on Bottom Layer: 9.44,35.32 12.47,35.32 12.47,30.27 9.44,30.27
$1N12198 on Bottom Layer: 21,4.54 24.84,4.54 24.84,3.71 21,3.71

## Text on the board
Bottom Silkscreen Layer: ▲ | |A3.3V| | |+3.3V| | |+5V| | MT6701 | |+12V| | PGND | VCC
Top Silkscreen Layer: CANH | CANL | PGND | +24V | SCK | SWD | GND | 3.3V | RX | TX | FOC_FD6288Q / Version->V2.0 | Driver> | FD6288Q | Motor 3508 | MCU> | STM32G431CBU6 | |RST| | C | A | B
